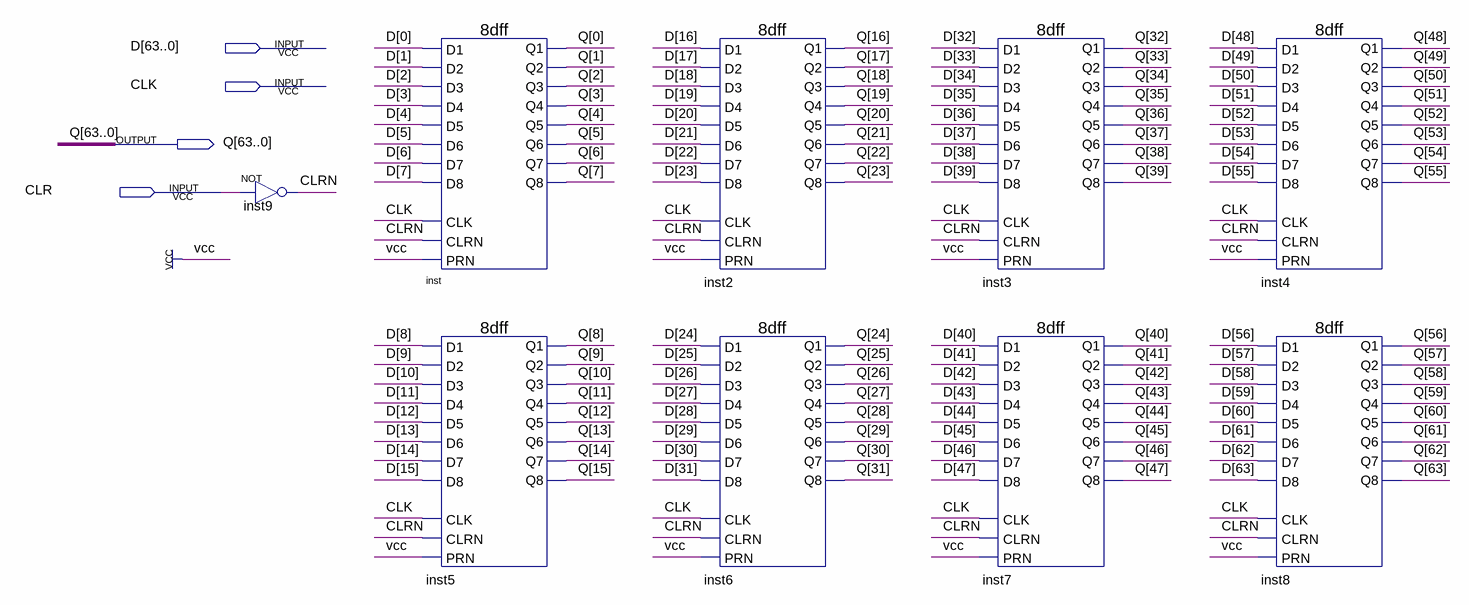
[diagram p0: schematic sheet]
// Quartus schematic Register_64_bit.bdf as structural Verilog: 9 symbols, 4 pins
module Register_64_bit (
  input  [63:0] D,
  input  CLK,
  input  CLR,
  output [63:0] Q
);

  wire CLRN;

  not inst9 (CLRN, CLR);
  \8dff  inst (
    .D4(D[3]), .D3(D[2]), .D5(D[4]), .D8(D[7]), .D7(D[6]), .PRN(1'b1), .CLK(CLK), .D6(D[5]), .CLRN(CLRN),
    .D2(D[1]), .D1(D[0]), .Q1(Q[0]), .Q8(Q[7]), .Q5(Q[4]), .Q6(Q[5]), .Q7(Q[6]), .Q4(Q[3]), .Q3(Q[2]),
    .Q2(Q[1]));
  \8dff  inst5 (
    .D4(D[11]), .D3(D[10]), .D5(D[12]), .D8(D[15]), .D7(D[14]), .PRN(1'b1), .CLK(CLK), .D6(D[13]),
    .CLRN(CLRN), .D2(D[9]), .D1(D[8]), .Q1(Q[8]), .Q8(Q[15]), .Q5(Q[12]), .Q6(Q[13]), .Q7(Q[14]), .Q4(Q[11]),
    .Q3(Q[10]), .Q2(Q[9]));
  \8dff  inst2 (
    .D4(D[19]), .D3(D[18]), .D5(D[20]), .D8(D[23]), .D7(D[22]), .PRN(1'b1), .CLK(CLK), .D6(D[21]),
    .CLRN(CLRN), .D2(D[17]), .D1(D[16]), .Q1(Q[16]), .Q8(Q[23]), .Q5(Q[20]), .Q6(Q[21]), .Q7(Q[22]),
    .Q4(Q[19]), .Q3(Q[18]), .Q2(Q[17]));
  \8dff  inst6 (
    .D4(D[27]), .D3(D[26]), .D5(D[28]), .D8(D[31]), .D7(D[30]), .PRN(1'b1), .CLK(CLK), .D6(D[29]),
    .CLRN(CLRN), .D2(D[25]), .D1(D[24]), .Q1(Q[24]), .Q8(Q[31]), .Q5(Q[28]), .Q6(Q[29]), .Q7(Q[30]),
    .Q4(Q[27]), .Q3(Q[26]), .Q2(Q[25]));
  \8dff  inst3 (
    .D4(D[35]), .D3(D[34]), .D5(D[36]), .D8(D[39]), .D7(D[38]), .PRN(1'b1), .CLK(CLK), .D6(D[37]),
    .CLRN(CLRN), .D2(D[33]), .D1(D[32]), .Q1(Q[32]), .Q8(Q[39]), .Q5(Q[36]), .Q6(Q[37]), .Q7(Q[38]),
    .Q4(Q[35]), .Q3(Q[34]), .Q2(Q[33]));
  \8dff  inst7 (
    .D4(D[43]), .D3(D[42]), .D5(D[44]), .D8(D[47]), .D7(D[46]), .PRN(1'b1), .CLK(CLK), .D6(D[45]),
    .CLRN(CLRN), .D2(D[41]), .D1(D[40]), .Q1(Q[40]), .Q8(Q[47]), .Q5(Q[44]), .Q6(Q[45]), .Q7(Q[46]),
    .Q4(Q[43]), .Q3(Q[42]), .Q2(Q[41]));
  \8dff  inst4 (
    .D4(D[51]), .D3(D[50]), .D5(D[52]), .D8(D[55]), .D7(D[54]), .PRN(1'b1), .CLK(CLK), .D6(D[53]),
    .CLRN(CLRN), .D2(D[49]), .D1(D[48]), .Q1(Q[48]), .Q8(Q[55]), .Q5(Q[52]), .Q6(Q[53]), .Q7(Q[54]),
    .Q4(Q[51]), .Q3(Q[50]), .Q2(Q[49]));
  \8dff  inst8 (
    .D4(D[59]), .D3(D[58]), .D5(D[60]), .D8(D[63]), .D7(D[62]), .PRN(1'b1), .CLK(CLK), .D6(D[61]),
    .CLRN(CLRN), .D2(D[57]), .D1(D[56]), .Q1(Q[56]), .Q8(Q[63]), .Q5(Q[60]), .Q6(Q[61]), .Q7(Q[62]),
    .Q4(Q[59]), .Q3(Q[58]), .Q2(Q[57]));
endmodule
